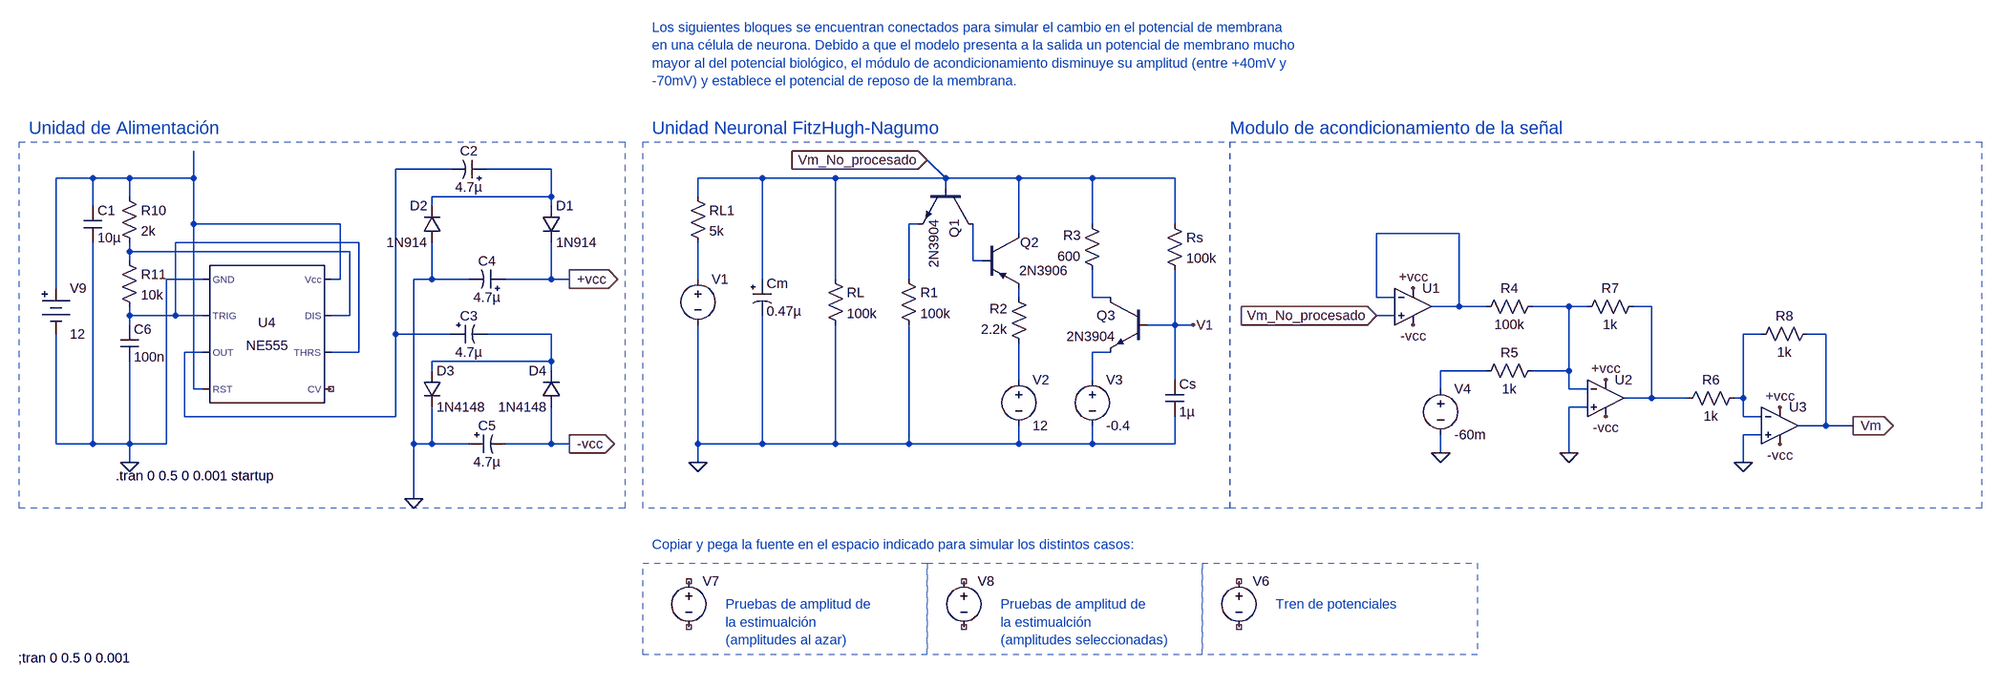
[diagram p0: schematic Modulo UN FitzHugh-Nagumo.asc]
Modulo UN FitzHugh-Nagumo.asc, the LTspice schematic file:
Version 4
SHEET 1 2272 1028
WIRE -560 -208 -656 -208
WIRE -384 -208 -496 -208
WIRE -1184 -192 -1248 -192
WIRE -1120 -192 -1184 -192
WIRE -1008 -192 -1008 -240
WIRE -1008 -192 -1120 -192
WIRE -16 -192 -128 -192
WIRE 112 -192 -16 -192
WIRE 304 -192 272 -224
WIRE 304 -192 112 -192
WIRE 432 -192 304 -192
WIRE 560 -192 432 -192
WIRE 704 -192 560 -192
WIRE 304 -176 304 -192
WIRE -1120 -160 -1120 -192
WIRE -384 -160 -384 -208
WIRE -384 -160 -592 -160
WIRE -128 -160 -128 -192
WIRE -1184 -144 -1184 -192
WIRE -592 -144 -592 -160
WIRE -384 -144 -384 -160
WIRE -1008 -112 -1008 -192
WIRE -752 -112 -1008 -112
WIRE 256 -112 240 -112
WIRE 560 -112 560 -192
WIRE 704 -112 704 -192
WIRE 432 -96 432 -192
WIRE 1200 -96 1056 -96
WIRE -720 -80 -1040 -80
WIRE -1120 -64 -1120 -80
WIRE -736 -64 -1120 -64
WIRE -1120 -48 -1120 -64
WIRE 352 -48 352 -112
WIRE 368 -48 352 -48
WIRE -992 -16 -1056 -16
WIRE -752 -16 -752 -112
WIRE -752 -16 -768 -16
WIRE -592 -16 -592 -80
WIRE -592 -16 -624 -16
WIRE -528 -16 -592 -16
WIRE -384 -16 -384 -80
WIRE -384 -16 -464 -16
WIRE -352 -16 -384 -16
WIRE -128 -16 -128 -80
WIRE -16 -16 -16 -192
WIRE 112 -16 112 -192
WIRE 240 -16 240 -112
WIRE -1248 0 -1248 -192
WIRE 432 16 432 0
WIRE 560 16 560 -32
WIRE 592 16 560 16
WIRE 1056 16 1056 -96
WIRE 1088 16 1056 16
WIRE 1200 32 1200 -96
WIRE 1200 32 1152 32
WIRE 1248 32 1200 32
WIRE 1392 32 1328 32
WIRE 1424 32 1392 32
WIRE 1536 32 1504 32
WIRE -1120 48 -1120 32
WIRE -1040 48 -1040 -80
WIRE -1040 48 -1120 48
WIRE -992 48 -1040 48
WIRE -736 48 -736 -64
WIRE -736 48 -768 48
WIRE 1088 48 1056 48
WIRE -1120 64 -1120 48
WIRE 704 64 704 -32
WIRE 704 64 656 64
WIRE 736 64 704 64
WIRE -656 80 -656 -208
WIRE -560 80 -656 80
WIRE -384 80 -496 80
WIRE 1728 80 1696 80
WIRE 1840 80 1808 80
WIRE -992 112 -1024 112
WIRE -720 112 -720 -80
WIRE -720 112 -768 112
WIRE 592 112 560 112
WIRE -384 128 -384 80
WIRE -384 128 -592 128
WIRE -592 144 -592 128
WIRE -384 144 -384 128
WIRE 1248 144 1168 144
WIRE 1392 144 1392 32
WIRE 1392 144 1328 144
WIRE 432 160 432 96
WIRE 560 160 560 112
WIRE 704 160 704 64
WIRE -1008 176 -1008 -112
WIRE -992 176 -1008 176
WIRE 1168 176 1168 144
WIRE 1392 176 1392 144
WIRE 1424 176 1392 176
WIRE 1536 192 1536 32
WIRE 1536 192 1488 192
WIRE 1600 192 1536 192
WIRE 1696 192 1696 80
WIRE 1696 192 1680 192
WIRE 1424 208 1392 208
WIRE -1024 224 -1024 112
WIRE -656 224 -656 80
WIRE -656 224 -1024 224
WIRE 1696 224 1696 192
WIRE 1728 224 1696 224
WIRE 1840 240 1840 80
WIRE 1840 240 1792 240
WIRE 1888 240 1840 240
WIRE 1728 256 1696 256
WIRE -1248 272 -1248 80
WIRE -1184 272 -1184 -80
WIRE -1184 272 -1248 272
WIRE -1120 272 -1120 128
WIRE -1120 272 -1184 272
WIRE -1056 272 -1056 -16
WIRE -1056 272 -1120 272
WIRE -624 272 -624 -16
WIRE -592 272 -592 208
WIRE -592 272 -624 272
WIRE -528 272 -592 272
WIRE -384 272 -384 208
WIRE -384 272 -464 272
WIRE -352 272 -384 272
WIRE -128 272 -128 64
WIRE -16 272 -16 48
WIRE -16 272 -128 272
WIRE 112 272 112 64
WIRE 112 272 -16 272
WIRE 240 272 240 64
WIRE 240 272 112 272
WIRE 432 272 432 240
WIRE 432 272 240 272
WIRE 560 272 560 240
WIRE 560 272 432 272
WIRE 704 272 704 224
WIRE 704 272 560 272
WIRE 1168 288 1168 256
WIRE 1392 288 1392 208
WIRE -1120 304 -1120 272
WIRE -128 304 -128 272
WIRE 1696 304 1696 256
WIRE -624 368 -624 272
FLAG -128 304 0
FLAG 1120 0 +vcc
FLAG 1120 64 -vcc
FLAG 1392 288 0
FLAG 1168 288 0
FLAG 1456 224 -vcc
FLAG 1456 160 +vcc
FLAG 1760 272 -vcc
FLAG 1760 208 +vcc
FLAG 1696 304 0
FLAG 1888 240 Vm
IOPIN 1888 240 Out
FLAG 1056 48 Vm_No_procesado
IOPIN 1056 48 In
FLAG -1120 304 0
FLAG -352 -16 +vcc
IOPIN -352 -16 Out
FLAG -624 368 0
FLAG -352 272 -vcc
IOPIN -352 272 Out
FLAG 736 64 V1
FLAG 272 -224 Vm_No_procesado
IOPIN 272 -224 In
SYMBOL res 96 -32 R0
SYMATTR InstName RL
SYMATTR Value 100k
SYMBOL res 224 -32 R0
SYMATTR InstName R1
SYMATTR Value 100k
SYMBOL res 448 112 R180
WINDOW 0 36 76 Left 2
WINDOW 3 36 40 Left 2
SYMATTR InstName R2
SYMATTR Value 2.2k
SYMBOL res 688 -128 R0
SYMATTR InstName Rs
SYMATTR Value 100k
SYMBOL cap 688 160 R0
SYMATTR InstName Cs
SYMATTR Value 1µ
SYMBOL npn 352 -176 R90
SYMATTR InstName Q1
SYMATTR Value 2N3904
SYMBOL pnp 368 -96 R0
WINDOW 0 66 16 Left 2
WINDOW 3 65 65 Left 2
SYMATTR InstName Q2
SYMATTR Value 2N3906
SYMBOL npn 656 16 M0
SYMATTR InstName Q3
SYMATTR Value 2N3904
SYMBOL polcap -32 -16 R0
SYMATTR InstName Cm
SYMATTR Value 0.47µ
SYMBOL res 576 -16 R180
WINDOW 0 36 76 Left 2
WINDOW 3 36 40 Left 2
SYMATTR InstName R3
SYMATTR Value 600
SYMBOL OpAmps\\UniversalOpAmp 1120 32 R0
SYMATTR InstName U1
SYMBOL OpAmps\\UniversalOpAmp 1456 192 R0
SYMATTR InstName U2
SYMBOL OpAmps\\UniversalOpAmp 1760 240 R0
SYMATTR InstName U3
SYMBOL res 1344 16 R90
WINDOW 0 0 56 VBottom 2
WINDOW 3 32 56 VTop 2
SYMATTR InstName R4
SYMATTR Value 100k
SYMBOL res 1344 128 R90
WINDOW 0 0 56 VBottom 2
WINDOW 3 32 56 VTop 2
SYMATTR InstName R5
SYMATTR Value 1k
SYMBOL res 1696 176 R90
WINDOW 0 0 56 VBottom 2
WINDOW 3 32 56 VTop 2
SYMATTR InstName R6
SYMATTR Value 1k
SYMBOL res 1520 16 R90
WINDOW 0 0 56 VBottom 2
WINDOW 3 32 56 VTop 2
SYMATTR InstName R7
SYMATTR Value 1k
SYMBOL res 1824 64 R90
WINDOW 0 0 56 VBottom 2
WINDOW 3 32 56 VTop 2
SYMATTR InstName R8
SYMATTR Value 1k
SYMBOL voltage 1168 160 R0
WINDOW 123 0 0 Left 0
WINDOW 39 0 0 Left 0
SYMATTR InstName V4
SYMATTR Value -60m
SYMBOL voltage -144 496 R0
WINDOW 123 0 0 Left 0
WINDOW 39 0 0 Left 0
WINDOW 3 24 44 Invisible 2
SYMATTR Value PWL(0 0 5m 0 5.0000001m 0.5 15m 0.5 15.000001m 0 40m 0 40.000001m 1 70m 1 70.00001m 0 130m 0 130.00001m 2 150m 2 150.00001m 0 190m 0 190.00001m 3 200m 3 200.00001m 0 240m 0 240.00001m 5 250m 5 250.00001m 0 290m 0 290.00001m 5 330m 5 330.00001m 0 350m 0 350.00001m 5 400m 5 400.00001m 0 430m 0 430.00001m 7 450m 7 450.00001m 0 480m 0 480.00001m 7 520m 7 520.00001m 0 550m 0 550.00001m 1 610m 1 610.00001m 0 700m 0 700.00001m 0.5 760m 0.5 760.00001m 0 780m 0 780.00001m 1 870.m 1 870.00001m 0)
SYMATTR InstName V7
SYMBOL voltage 336 496 R0
WINDOW 123 0 0 Left 0
WINDOW 39 0 0 Left 0
WINDOW 3 24 44 Invisible 2
SYMATTR Value PWL(0 0 5m 0 5.0000001m 0.5 15m 0.5 15.000001m 0 70m 0 70.000001m 1 80m 1 80.000001m 0 135m 0 135.000001m 2 145m 2 145.000001m 0 200m 0 200.000001m 3 210m 3 210.000001m 0 265m 0 265.000001m 4 275m 4 275.000001m 0 330m 0 330.00001m 5 340m 5 340.000001m 0)
SYMATTR InstName V8
SYMBOL voltage 816 496 R0
WINDOW 3 -35 356 Invisible 2
WINDOW 123 0 0 Left 0
WINDOW 39 0 0 Left 0
SYMATTR Value PULSE(0 5 0 1f 1f 10m 50m)
SYMATTR InstName V6
SYMBOL Misc\\NE555 -880 80 R0
SYMATTR InstName U4
SYMBOL res -1136 -176 R0
SYMATTR InstName R10
SYMATTR Value 2k
SYMBOL res -1136 -64 R0
SYMATTR InstName R11
SYMATTR Value 10k
SYMBOL cap -1200 -144 R0
SYMATTR InstName C1
SYMATTR Value 10µ
SYMBOL polcap -496 -192 M270
WINDOW 0 32 32 VTop 2
WINDOW 3 0 32 VBottom 2
SYMATTR InstName C2
SYMATTR Value 4.7µ
SYMBOL polcap -560 64 M90
WINDOW 0 0 32 VBottom 2
WINDOW 3 32 32 VTop 2
SYMATTR InstName C3
SYMATTR Value 4.7µ
SYMBOL polcap -464 0 M270
WINDOW 0 32 32 VTop 2
WINDOW 3 0 32 VBottom 2
SYMATTR InstName C4
SYMATTR Value 4.7µ
SYMBOL polcap -528 256 M90
WINDOW 0 0 32 VBottom 2
WINDOW 3 32 32 VTop 2
SYMATTR InstName C5
SYMATTR Value 4.7µ
SYMBOL diode -400 -144 R0
SYMATTR InstName D1
SYMATTR Value 1N914
SYMBOL diode -576 -80 R180
WINDOW 0 24 64 Left 2
WINDOW 3 24 0 Left 2
SYMATTR InstName D2
SYMATTR Value 1N914
SYMBOL diode -608 144 R0
SYMATTR InstName D3
SYMATTR Value 1N4148
SYMBOL diode -368 208 R180
WINDOW 0 24 64 Left 2
WINDOW 3 24 0 Left 2
SYMATTR InstName D4
SYMATTR Value 1N4148
SYMBOL cap -1136 64 R0
SYMATTR InstName C6
SYMATTR Value 100n
SYMBOL Misc\\battery -1248 -16 R0
WINDOW 123 0 0 Left 0
WINDOW 39 0 0 Left 0
SYMATTR InstName V9
SYMATTR Value 12
SYMBOL res -144 -176 R0
SYMATTR InstName RL1
SYMATTR Value 5k
SYMBOL voltage -128 -32 R0
WINDOW 3 24 96 Invisible 2
WINDOW 123 0 0 Left 0
WINDOW 39 0 0 Left 0
SYMATTR InstName V1
SYMATTR Value PULSE(0 5v 0 1f 1f 1m 30m)
SYMBOL voltage 432 144 R0
WINDOW 123 0 0 Left 0
WINDOW 39 0 0 Left 0
SYMATTR InstName V2
SYMATTR Value 12
SYMBOL voltage 560 144 R0
WINDOW 123 0 0 Left 0
WINDOW 39 0 0 Left 0
SYMATTR InstName V3
SYMATTR Value -0.4
TEXT -208 -280 Left 3 ;Unidad Neuronal FitzHugh-Nagumo
TEXT 800 -280 Left 3 ;Modulo de acondicionamiento de la señal
TEXT -208 -456 Left 2 ;Los siguientes bloques se encuentran conectados para simular el cambio en el potencial de membrana\nen una célula de neurona. Debido a que el modelo presenta a la salida un potencial de membrano mucho\nmayor al del potencial biológico, el módulo de acondicionamiento disminuye su amplitud (entre +40mV y \n-70mV) y establece el potencial de reposo de la membrana.
TEXT -80 552 Left 2 ;Pruebas de amplitud de \nla estimualción\n(amplitudes al azar)
TEXT 400 552 Left 2 ;Pruebas de amplitud de \nla estimualción\n(amplitudes seleccionadas)
TEXT -208 448 Left 2 ;Copiar y pega la fuente en el espacio indicado para simular los distintos casos:
TEXT 880 552 Left 2 ;Tren de potenciales
TEXT -1144 328 Left 2 !.tran 0 0.5 0 0.001 startup
TEXT -1296 -280 Left 3 ;Unidad de Alimentación
TEXT -1314 646 Left 2 !;tran 0 0.5 0 0.001
RECTANGLE Normal 800 384 -224 -256 2
RECTANGLE Normal 2112 384 800 -256 2
RECTANGLE Normal 272 640 -224 480 2
RECTANGLE Normal 752 640 272 480 2
RECTANGLE Normal 1232 640 752 480 2
RECTANGLE Normal -256 384 -1312 -256 2

The netlist it stands for:
* Modulo UN FitzHugh-Nagumo.asc
RL Vm_No_procesado 0 100k
R1 N004 0 100k
R2 N018 N010 2.2k
Rs Vm_No_procesado V1 100k
Cs V1 0 1µ
Q1 N008 Vm_No_procesado N004 0 2N3904
Q2 Vm_No_procesado N008 N010 0 2N3906
Q3 N011 V1 N016 0 2N3904
Cm Vm_No_procesado 0 0.47µ
R3 N011 Vm_No_procesado 600
XU1 Vm_No_procesado N005 +vcc -vcc N005 level1 Avol=1Meg GBW=10Meg Vos=0 En=0 Enk=0 In=0 Ink=0 Rin=500Meg  ; pins In+ In- V+ V- OUT
XU2 0 N012 +vcc -vcc N013 level1 Avol=1Meg GBW=10Meg Vos=0 En=0 Enk=0 In=0 Ink=0 Rin=500Meg  ; pins In+ In- V+ V- OUT
XU3 0 N015 +vcc -vcc Vm level1 Avol=1Meg GBW=10Meg Vos=0 En=0 Enk=0 In=0 Ink=0 Rin=500Meg  ; pins In+ In- V+ V- OUT
R4 N012 N005 100k
R5 N012 N017 1k
R6 N015 N013 1k
R7 N013 N012 1k
R8 Vm N015 1k
V4 N017 0 -60m
V7 NC_01 NC_02 PWL(0 0 5m 0 5.0000001m 0.5 15m 0.5 15.000001m 0 40m 0 40.000001m 1 70m 1 70.00001m 0 130m 0 130.00001m 2 150m 2 150.00001m 0 190m 0 190.00001m 3 200m 3 200.00001m 0 240m 0 240.00001m 5 250m 5 250.00001m 0 290m 0 290.00001m 5 330m 5 330.00001m 0 350m 0 350.00001m 5 400m 5 400.00001m 0 430m 0 430.00001m 7 450m 7 450.00001m 0 480m 0 480.00001m 7 520m 7 520.00001m 0 550m 0 550.00001m 1 610m 1 610.00001m 0 700m 0 700.00001m 0.5 760m 0.5 760.00001m 0 780m 0 780.00001m 1 870.m 1 870.00001m 0)
V8 NC_03 NC_04 PWL(0 0 5m 0 5.0000001m 0.5 15m 0.5 15.000001m 0 70m 0 70.000001m 1 80m 1 80.000001m 0 135m 0 135.000001m 2 145m 2 145.000001m 0 200m 0 200.000001m 3 210m 3 210.000001m 0 265m 0 265.000001m 4 275m 4 275.000001m 0 330m 0 330.00001m 5 340m 5 340.000001m 0)
V6 NC_05 NC_06 PULSE(0 5 0 1f 1f 10m 50m)
XU4 0 N006 N001 N003 NC_07 N006 N007 N003 NE555  ; pins GND TRIG OUT RST CV THRS DIS Vcc
R10 N003 N007 2k
R11 N007 N006 10k
C1 N003 0 10µ
C2 N002 N001 4.7µ
C3 N001 N014 4.7µ
C4 +vcc 0 4.7µ
C5 0 -vcc 4.7µ
D1 N002 +vcc 1N914
D2 0 N002 1N914
D3 N014 0 1N4148
D4 -vcc N014 1N4148
C6 N006 0 100n
V9 N003 0 12
RL1 Vm_No_procesado N009 5k
V1 N009 0 PULSE(0 5v 0 1f 1f 1m 30m)
V2 N018 0 12
V3 N016 0 -0.4
.model D D
.lib standard.dio
.model NPN NPN
.model PNP PNP
.lib standard.bjt
* Unidad Neuronal FitzHugh-Nagumo
* Modulo de acondicionamiento de la señal
* Los siguientes bloques se encuentran conectados para simular el cambio en el potencial de membrana
* en una célula de neurona. Debido a que el modelo presenta a la salida un potencial de membrano mucho
* mayor al del potencial biológico, el módulo de acondicionamiento disminuye su amplitud (entre +40mV y
* -70mV) y establece el potencial de reposo de la membrana.
* Pruebas de amplitud de
* la estimualción
* (amplitudes al azar)
* Pruebas de amplitud de
* la estimualción
* (amplitudes seleccionadas)
* Copiar y pega la fuente en el espacio indicado para simular los distintos casos:
* Tren de potenciales
.tran 0 0.5 0 0.001 startup
* Unidad de Alimentación
;tran 0 0.5 0 0.001
.lib UniversalOpAmp1.lib
.lib NE555.sub
.backanno
.end